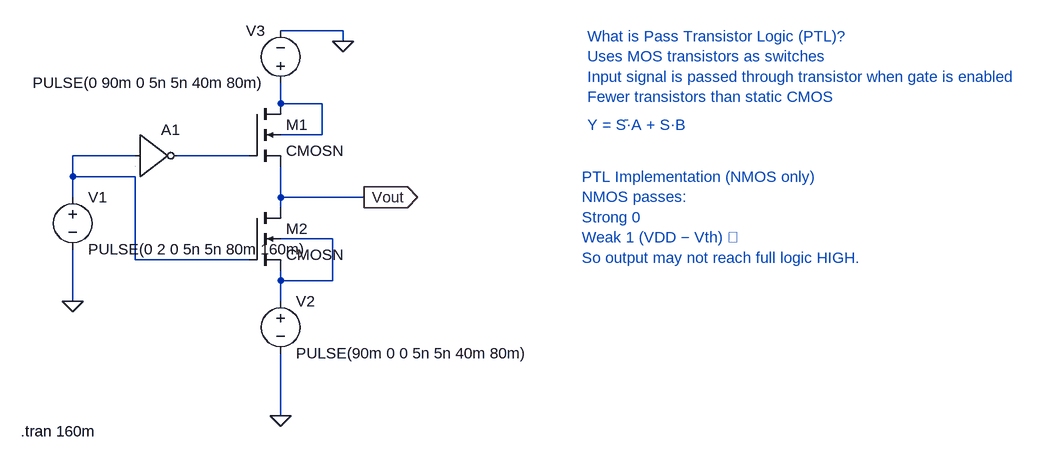
[diagram p0: schematic PTL_Mux.asc]
PTL_Mux.asc, the LTspice schematic file:
Version 4
SHEET 1 1476 680
WIRE 368 -64 272 -64
WIRE 368 -48 368 -64
WIRE 272 48 272 16
WIRE 336 48 272 48
WIRE 336 96 336 48
WIRE 336 96 272 96
WIRE 48 128 -48 128
WIRE 224 128 112 128
WIRE -48 160 -48 128
WIRE 48 160 -48 160
WIRE -48 192 -48 160
WIRE 272 192 272 144
WIRE 400 192 272 192
WIRE 272 208 272 192
WIRE 352 256 272 256
WIRE 48 288 48 160
WIRE 224 288 48 288
WIRE 272 320 272 304
WIRE 352 320 352 256
WIRE 352 320 272 320
WIRE -48 352 -48 272
WIRE 272 352 272 320
WIRE 272 528 272 432
FLAG -48 352 0
FLAG 272 528 0
FLAG 368 -48 0
FLAG 400 192 Vout
IOPIN 400 192 Out
SYMBOL Digital\\inv 48 64 R0
SYMATTR InstName A1
SYMBOL cmosn 224 48 R0
SYMATTR InstName M1
SYMBOL cmosn 224 208 R0
SYMATTR InstName M2
SYMBOL voltage -48 176 R0
WINDOW 123 0 0 Left 0
WINDOW 39 0 0 Left 0
SYMATTR InstName V1
SYMATTR Value PULSE(0 2 0 5n 5n 80m 160m)
SYMBOL voltage 272 336 R0
WINDOW 123 0 0 Left 0
WINDOW 39 0 0 Left 0
SYMATTR InstName V2
SYMATTR Value PULSE(90m 0 0 5n 5n 40m 80m)
SYMBOL voltage 272 32 R180
WINDOW 0 24 96 Left 2
WINDOW 3 24 16 Left 2
WINDOW 123 0 0 Left 0
WINDOW 39 0 0 Left 0
SYMATTR InstName V3
SYMATTR Value PULSE(0 90m 0 5n 5n 40m 80m)
TEXT -128 552 Left 2 !.tran 160m
TEXT 744 -56 Left 2 ;What is Pass Transistor Logic (PTL)?\nUses MOS transistors as switches\nInput signal is passed through transistor when gate is enabled\nFewer transistors than static CMOS
TEXT 744 80 Left 2 ;Y = S̄·A + S·B
TEXT 736 160 Left 2 ;PTL Implementation (NMOS only)\nNMOS passes:\nStrong 0\nWeak 1 (VDD − Vth) ❌\nSo output may not reach full logic HIGH.

The netlist it stands for:
* PTL_Mux.asc
A1 N002 0 0 0 0 N003 0 0 BUF
M1 N001 N003 Vout N001 CMOSN
M2 Vout N002 N004 N004 CMOSN
V1 N002 0 PULSE(0 2 0 5n 5n 80m 160m)
V2 N004 0 PULSE(90m 0 0 5n 5n 40m 80m)
V3 N001 0 PULSE(0 90m 0 5n 5n 40m 80m)
.model NMOS NMOS
.model PMOS PMOS
.lib standard.mos
.tran 160m
* What is Pass Transistor Logic (PTL)?
* Uses MOS transistors as switches
* Input signal is passed through transistor when gate is enabled
* Fewer transistors than static CMOS
* Y = S̄·A + S·B
* PTL Implementation (NMOS only)
* NMOS passes:
* Strong 0
* Weak 1 (VDD − Vth) ❌
* So output may not reach full logic HIGH.
.backanno
.end